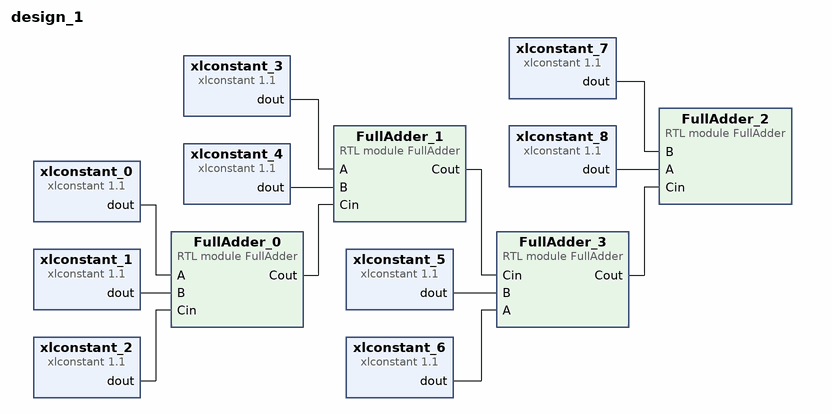
[diagram p0: block diagram of the top level]
# Vivado block design design_1, xc7z020clg400-1, Vivado 2023.1
create_bd_design design_1

create_bd_cell -type module -reference FullAdder FullAdder_0
create_bd_cell -type module -reference FullAdder FullAdder_1
create_bd_cell -type module -reference FullAdder FullAdder_2
create_bd_cell -type module -reference FullAdder FullAdder_3
create_bd_cell -type ip -vlnv xilinx.com:ip:xlconstant:1.1 xlconstant_0
set_property -dict {CONFIG.CONST_VAL 0} [get_bd_cells xlconstant_0]
create_bd_cell -type ip -vlnv xilinx.com:ip:xlconstant:1.1 xlconstant_1
set_property -dict {CONFIG.CONST_VAL 0} [get_bd_cells xlconstant_1]
create_bd_cell -type ip -vlnv xilinx.com:ip:xlconstant:1.1 xlconstant_2
set_property -dict {CONFIG.CONST_VAL 1} [get_bd_cells xlconstant_2]
create_bd_cell -type ip -vlnv xilinx.com:ip:xlconstant:1.1 xlconstant_3
set_property -dict {CONFIG.CONST_VAL 1} [get_bd_cells xlconstant_3]
create_bd_cell -type ip -vlnv xilinx.com:ip:xlconstant:1.1 xlconstant_4
set_property -dict {CONFIG.CONST_VAL 1} [get_bd_cells xlconstant_4]
create_bd_cell -type ip -vlnv xilinx.com:ip:xlconstant:1.1 xlconstant_5
set_property -dict {CONFIG.CONST_VAL 0} [get_bd_cells xlconstant_5]
create_bd_cell -type ip -vlnv xilinx.com:ip:xlconstant:1.1 xlconstant_6
set_property -dict {CONFIG.CONST_VAL 0} [get_bd_cells xlconstant_6]
create_bd_cell -type ip -vlnv xilinx.com:ip:xlconstant:1.1 xlconstant_7
set_property -dict {CONFIG.CONST_VAL 0} [get_bd_cells xlconstant_7]
create_bd_cell -type ip -vlnv xilinx.com:ip:xlconstant:1.1 xlconstant_8
set_property -dict {CONFIG.CONST_VAL 0} [get_bd_cells xlconstant_8]

# ---- connections ----

connect_bd_net [get_bd_pins FullAdder_0/Cout] [get_bd_pins FullAdder_1/Cin]
connect_bd_net [get_bd_pins FullAdder_1/Cout] [get_bd_pins FullAdder_3/Cin]
connect_bd_net [get_bd_pins FullAdder_3/Cout] [get_bd_pins FullAdder_2/Cin]
connect_bd_net [get_bd_pins xlconstant_0/dout] [get_bd_pins FullAdder_0/A]
connect_bd_net [get_bd_pins xlconstant_1/dout] [get_bd_pins FullAdder_0/B]
connect_bd_net [get_bd_pins xlconstant_2/dout] [get_bd_pins FullAdder_0/Cin]
connect_bd_net [get_bd_pins xlconstant_3/dout] [get_bd_pins FullAdder_1/A]
connect_bd_net [get_bd_pins xlconstant_4/dout] [get_bd_pins FullAdder_1/B]
connect_bd_net [get_bd_pins xlconstant_5/dout] [get_bd_pins FullAdder_3/B]
connect_bd_net [get_bd_pins xlconstant_6/dout] [get_bd_pins FullAdder_3/A]
connect_bd_net [get_bd_pins xlconstant_7/dout] [get_bd_pins FullAdder_2/B]
connect_bd_net [get_bd_pins xlconstant_8/dout] [get_bd_pins FullAdder_2/A]

validate_bd_design
save_bd_design
